# EAGLE design TeamB_PowerBoard (EAGLE 7.1.0)
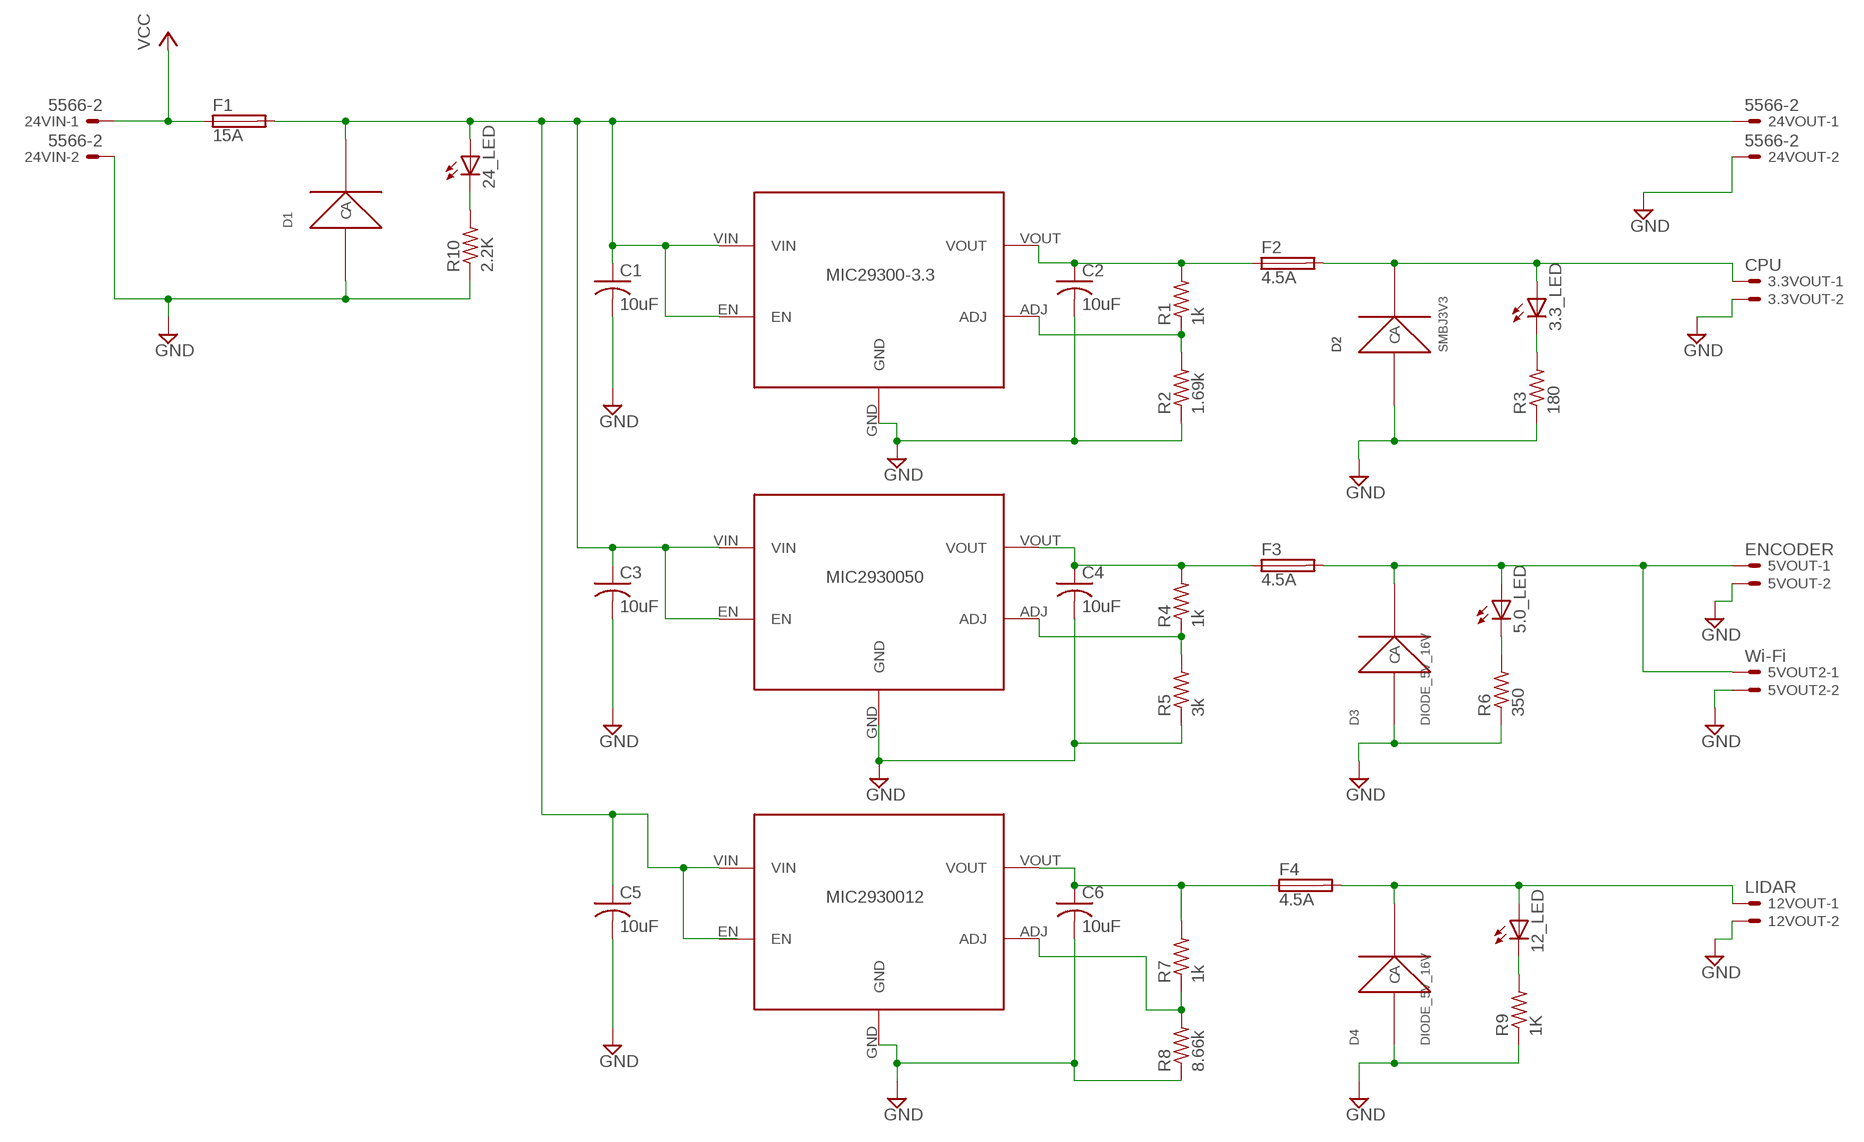
[diagram p0: schematic, sheet 1]

## Parts
3.3_LED  LEDSML1206  [SML1206]
3.3VOUT  CPU  C-GRID-02-70543  [70543-02]
5.0_LED  LEDSML1206  [SML1206]
5VOUT  ENCODER  C-GRID-02-70543  [70543-02]
5VOUT2  Wi-Fi  C-GRID-02-70543  [70543-02]
12_LED  LEDSML1206  [SML1206]
12VOUT  LIDAR  C-GRID-02-70543  [70543-02]
24_LED  LEDSML1206  [SML1206]
24VIN  5566-2  [5566-2]
24VOUT  5566-2  [5566-2]
C1  10uF  C-USC2220K  [C2220K]
C2  10uF  C-USC2220K  [C2220K]
C3  10uF  C-USC2220K  [C2220K]
C4  10uF  C-USC2220K  [C2220K]
C5  10uF  C-USC2220K  [C2220K]
C6  10uF  C-USC2220K  [C2220K]
D1  DIODE_26  [DIODE_26]
D2  SMBJ3V3  [SMBJ3V3]
D3  DIODE_5V_16V  [DIODE_5V_16V]
D4  DIODE_5V_16V  [DIODE_5V_16V]
F1  15A  TE5  [TE5]
F2  4.5A  TE5  [TE5]
F3  4.5A  TE5  [TE5]
F4  4.5A  TE5  [TE5]
R1  1k  R-US_R1206  [R1206]
R2  1.69k  R-US_R1206  [R1206]
R3  180  R-US_R1206  [R1206]
R4  1k  R-US_R1206  [R1206]
R5  3k  R-US_R1206  [R1206]
R6  350  R-US_R1206  [R1206]
R7  1k  R-US_R1206  [R1206]
R8  8.66k  R-US_R1206  [R1206]
R9  1K  R-US_R1206  [R1206]
R10  2.2K  R-US_R1206  [R1206]
U$1  MIC29300  [MIC29300WU]
U$2  MIC29300  [MIC29300WU]
U$3  MIC29300  [MIC29300WU]

## Nets
GND: 3.3VOUT.2 5VOUT2.2 5VOUT.2 12VOUT.2 24VIN.2 24VOUT.2 C1.2 C2.2 C3.2 C4.2 C5.2 C6.2 D1.1(A) D2.1(A) D3.1(A) D4.1(A) R2.1 R3.1 R5.1 R6.1 R8.1 R9.1 R10.1 U$1.GND U$2.GND U$3.GND
N$1: 24_LED.A 24VOUT.1 C1.1 C3.1 C5.1 D1.2(C) F1.2 U$1.EN U$1.VIN U$2.EN U$2.VIN U$3.VIN
N$2: 5.0_LED.C R6.2
N$3: 24_LED.C R10.2
N$4: 5.0_LED.A 5VOUT2.1 5VOUT.1 D3.2(C) F3.2
N$5: C2.1 F2.1 R1.2 U$1.VOUT
N$6: 12_LED.A 12VOUT.1 D4.2(C) F4.2
N$7: C4.1 F3.1 R4.2 U$2.VOUT
N$8: C6.1 F4.1 R7.2 U$3.VOUT
N$9: 3.3_LED.A 3.3VOUT.1 D2.2(C) F2.2
N$10: 12_LED.C R9.2
N$11: 3.3_LED.C R3.2
N$12: R1.1 R2.2 U$1.ADJ
N$13: R4.1 R5.2 U$2.ADJ
N$19: R7.1 R8.2 U$3.ADJ
VCC: 24VIN.1 F1.1
Unconnected: U$3.EN

## Library data of the parts
3.3_LED 5.0_LED 12_LED 24_LED = led:LED: LED OSRAM: - CHIPLED LG R971, LG N971, LY N971, LG Q971, LY Q971, LO R971, LY R971 LH N974, LH R974 LS Q976, LO Q976, LY Q976 LO Q996 - Hyper CHIPLED LW Q18S LB Q993, LB Q99A, LB R99A - SideLED LS A670, LO A670, LY A670, LG A670, LP A670 LB A673, LV A673, LT A673, LW A673 LH A674 LY A675 LS A676, LA A676, LO A676, LY A676, LW A676 LS A679, LY A679, LG A679 - Hyper Micro SIDELED® LS Y876, LA Y876, LO Y876, LY Y876 LT Y87S - SmartLED LW L88C, LW L88S LB L89C, LB L89S, LG L890 LS L89K, LO L89K, LY L89K LS L896, LA L896, LO L896, LY L896 - TOPLED LS T670, LO T670, LY T670, LG T670, LP T670 LSG T670, LSP T670, LSY T670, LOP T670, LYG T670 LG T671, LOG T671, LSG T671 LB T673, LV T673, LT T673, LW T673 LH T674 LS T676, LA T676, LO T676, LY T676, LB T676, LH T676, LSB T676, LW T676 LB T67C, LV T67C, LT T67C, LS T67K, LO T67K, LY T67K, LW E67C LS E67B, LA E67B, LO E67B, LY E67B, LB E67C, LV E67C, LT E67C LW T67C LS T679, LY T679, LG T679 LS T770, LO T770, LY T770, LG T770, LP T770 LB T773, LV T773, LT T773, LW T773 LH T774 LS E675, LA E675, LY E675, LS T675 LS T776, LA T776, LO T776, LY T776, LB T776 LHGB T686 LT T68C, LB T68C - Hyper Mini TOPLED® LB M676 - Mini TOPLED Santana® LG M470 LS M47K, LO M47K, LY M47K Source: http://www.osram.convergy.de LUXEON: - LUMILED® LXK2-PW12-R00, LXK2-PW12-S00, LXK2-PW14-U00, LXK2-PW14-V00 LXK2-PM12-R00, LXK2-PM12-S00, LXK2-PM14-U00 LXK2-PE12-Q00, LXK2-PE12-R00, LXK2-PE12-S00, LXK2-PE14-T00, LXK2-PE14-U00 LXK2-PB12-K00, LXK2-PB12-L00, LXK2-PB12-M00, LXK2-PB14-N00, LXK2-PB14-P00, LXK2-PB14-Q00 LXK2-PR12-L00, LXK2-PR12-M00, LXK2-PR14-Q00, LXK2-PR14-R00 LXK2-PD12-Q00, LXK2-PD12-R00, LXK2-PD12-S00 LXK2-PH12-R00, LXK2-PH12-S00 LXK2-PL12-P00, LXK2-PL12-Q00, LXK2-PL12-R00 Source: www.luxeon.com KINGBRIGHT: KA-3528ASYC Source: www.kingbright.com
3.3VOUT 5VOUT 5VOUT2 12VOUT = con-molex:C-GRID-02: CONNECTOR wire to board 2.54 mm (0.100") pitch header; OC_FARNELL: unknown; OC_NEWARK: unknown
24VIN 24VOUT = con-molex:5566-2: Mini FIT connector 2 pol Source: http://www.molex.com; OC_FARNELL: 1822072; OC_NEWARK: unknown
C1-C6 = resistor:C-US: CAPACITOR, American symbol
D1 = TVS_Diode:DIODE_26
D2 = TVS_Diode:SMBJ3V3
D3 D4 = TVS_Diode:DIODE_5V_16V
F1-F4 = fuse:TE5: FUSE Wickmann; OC_FARNELL: unknown; OC_NEWARK: unknown
R1-R10 = rcl:R-US_: RESISTOR, American symbol
U$1 = MIC2930033WU:MIC29300: MIC29150/29300/29500/29750 are high current, high accuracy, low-dropout voltage regulators.
U$2 = MIC2930050WU:MIC29300: MIC29150/29300/29500/29750 are high current, high accuracy, low-dropout voltage regulators.
U$3 = MIC2930012WU:MIC29300: MIC29150/29300/29500/29750 are high current, high accuracy, low-dropout voltage regulators.

## Board
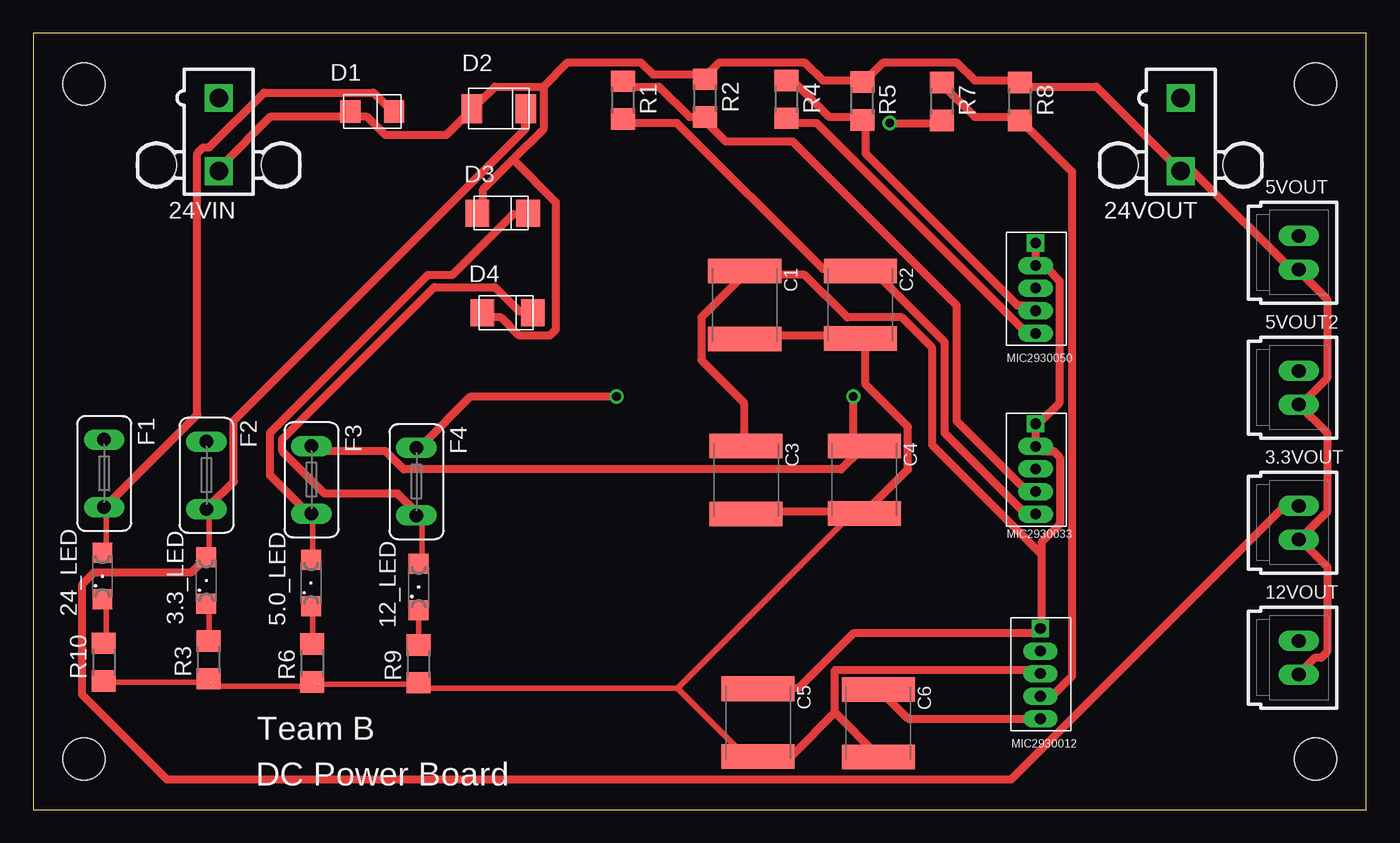
[diagram p1: board, top side]
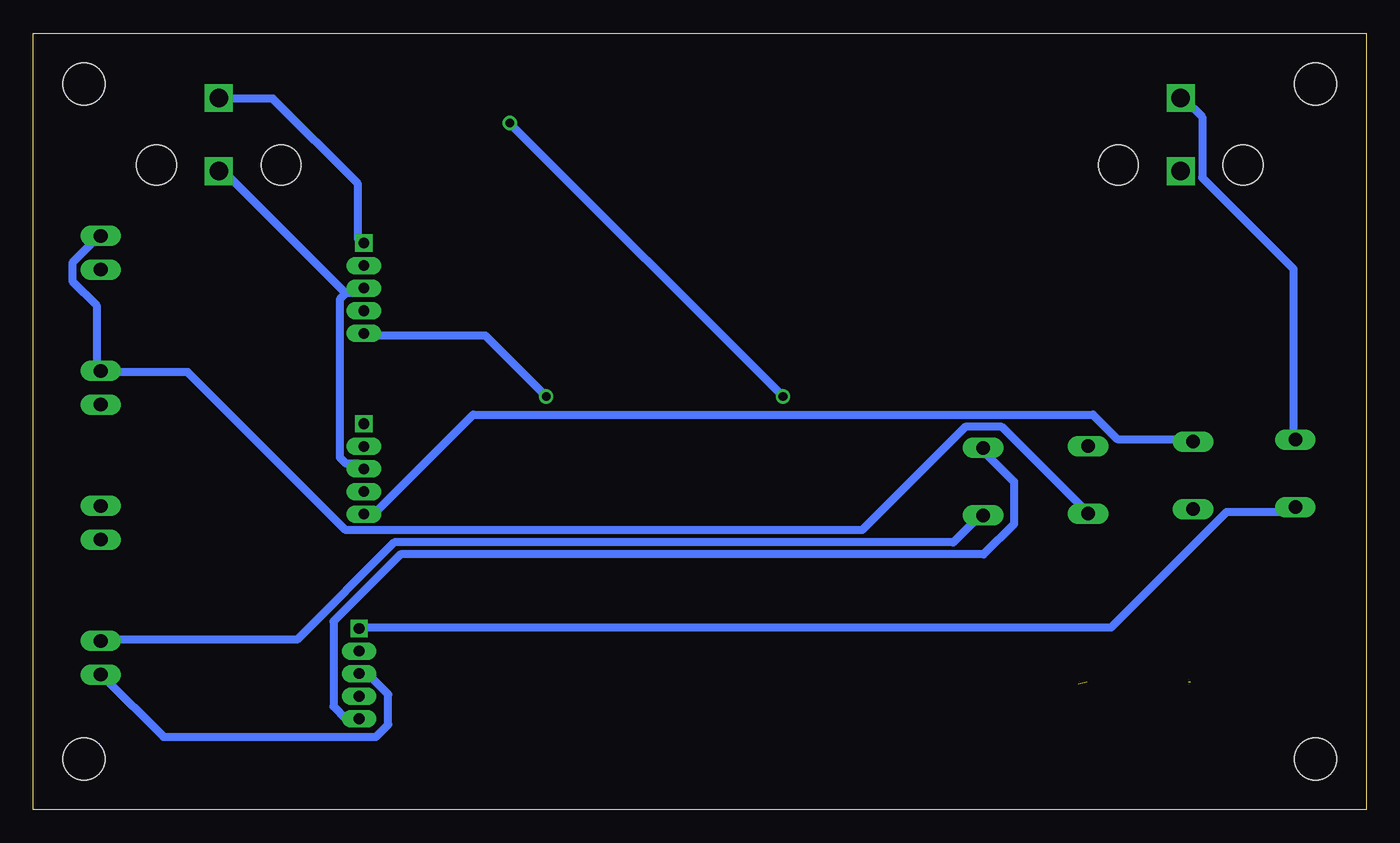
[diagram p2: board, bottom side, seen from below]

Size 100.33 x 58.42 mm. Coordinates in mm from the lower left corner, seen from the top.
Outline: 0,0 100.33,0 100.33,58.42 0,58.42 0,0
Copper layers (1*16): Top 0.035mm / dielectric 1.5mm / Bottom 0.035mm
Design rules "default *": minimum track width 12mil, minimum drill 26mil, track to track 12mil, track to pad 8mil, pad to pad 8mil, via to via 8mil, smd to smd 8mil, copper to edge 40mil, drill to drill 8mil, minimum pad ring 10mil, minimum via ring 8mil, stop-mask expansion 4mil, vias tented up to drill 0mil, thermal gap 10mil
Holes 3.17 mm at 3.81,3.81 96.52,3.81 96.52,54.61 3.81,54.61
tKeepout: area 1,51.8 to 6.6,57.4; area 1,1 to 6.6,6.6; area 93.7,1 to 99.3,6.6; area 93.7,51.8 to 99.3,57.4

### Footprints (pad centres in the part's own frame; a part is rotated, then mirrored left to right if it is on the bottom)
SML1206 = smd 1.5 x 1.5: A 1.75,0; C -1.75,0
70543-02 = drill 1.016 long: 1 -1.27,0; 2 1.27,0
5566-2 = drill 1.4 square: 1 0,-2.75; 2 0,2.75 | hole 3: 4.7,2.29; -4.7,2.29
C2220K = smd 1.85 x 5.5: 1 -2.55,0; 2 2.55,0
DIODE_26 = smd 1.524 x 1.676: 1 -0.762,0; 2 2.54,0
SMBJ3V3 = smd 1.524 x 2.184: 1 -2.032,0; 2 2.032,0
DIODE_5V_16V = smd 1.778 x 2.032: 1 -0.762,0; 2 3.048,0
TE5 = drill 1.016 long: 1 -2.54,0; 2 2.54,0
R1206 = smd 1.6 x 1.803: 1 -1.422,0; 2 1.422,0
MIC29300WU = drill 0.8 pad 1.27 long: ADJ 2.2,2.6; EN 2.2,6; GND 2.2,4.3; VOUT 2.2,0.9 | drill 0.8 pad 1.27 square: VIN 2.2,7.7

### Placement (x,y rotation side)
3.3_LED  13.03,17.24 90 top
3.3VOUT  95.25,21.59 270 top
5.0_LED  20.91,17.05 90 top
5VOUT  95.25,41.91 270 top
5VOUT2  95.25,31.75 270 top
12_LED  29.01,16.76 90 top
12VOUT  95.25,11.43 270 top
24_LED  5.21,17.57 90 top
24VIN  13.97,50.8 180 top
24VOUT  86.36,50.8 180 top
C1  53.55,37.97 270 top
C2  62.25,37.99 270 top
C3  53.65,24.81 270 top
C4  62.55,24.83 270 top
C5  54.55,6.55 270 top
C6  63.61,6.51 270 top
D1  24.63,52.54 0 top
D2  35.05,52.75 0 top
D3  34.2,44.89 0 top
D4  34.56,37.39 0 top
F1  5.34,25.3 270 top
F2  13.04,25.16 270 top
F3  20.94,24.82 270 top
F4  28.84,24.68 270 top
R1  44.4,53.38 270 top
R2  50.58,53.53 270 top
R3  13.19,11.28 90 top
R4  56.7,53.44 270 top
R5  62.4,53.32 270 top
R6  20.99,11.04 90 top
R7  68.4,53.28 270 top
R8  74.28,53.28 270 top
R9  28.99,10.98 90 top
R10  5.31,11.11 90 top
U$1  73.25,21.34 0 top
U$2  73.25,34.94 0 top
U$3  73.6,5.94 0 top

### Tracks (layer width: path | path; a pad name or v marks a point on that pad's centre or on a via)
GND  (2 unrouted)
  Top 0.406: 5.49,9.6 13.39,9.6 13.39,9.3 21.67,9.3 21.67,9.44 29.26,9.44 29.26,9.14 48.5,9.14 | 48.5,9.14 61.76,22.4 | 54.41,4.12 53.53,4.12 48.5,9.14
  Top 0.61: C1.2 53.95,35.66 62.18,35.66 C2.2 62.64,35.2 62.64,32 65.84,28.8 65.84,25.6 62.64,22.4 C4.2 62.18,22.4 61.76,22.4 53.95,22.4 C3.2 53.49,21.95 | 5.49,9.6 R10.1 | 12.8,9.6 R3.1 13.26,9.6 | 20.57,9.6 R6.1 21.03,9.6 | 28.8,9.6 R9.1 29.26,9.14 | 60.35,7.32 60.35,10.52 75.44,10.52 U$3.GND | 60.35,7.32 63.55,4.12 C6.2 | 60.35,7.32 57.15,4.12 54.86,4.12 C5.2 54.41,4.12 | 12VOUT.2 95.56,10.52 96.47,11.43 96.93,11.43 97.38,11.89 97.38,18.29 95.56,20.12 3.3VOUT.2 95.56,20.57 97.38,22.4 97.38,28.35 5VOUT2.2 95.56,30.63 97.38,32.46 97.38,38.41 95.56,40.23 5VOUT.2 95.1,40.23 87.33,48.01 86.41,48.01 24VOUT.2 85.95,48.46 80.01,54.41 74.52,54.41 R8.1 74.07,54.86 70.87,54.86 69.49,56.24 64.01,56.24 62.64,54.86 R5.1 62.18,54.86 59.44,54.86 58.06,56.24 51.66,56.24 50.75,55.32 R2.1 50.29,55.32 46.63,55.32 45.72,56.24 40.23,56.24 38.41,54.41 | 36.12,48.92 38.41,51.21 38.41,54.41 | 36.12,48.92 33.83,46.63 33.83,45.26 D3.1 | 38.41,54.41 34.75,54.41 33.38,53.03 D2.1 32.92,52.58 31.09,50.75 26.52,50.75 25.15,52.12 24.23,52.12 D1.1 23.77,52.12 17.83,52.12 14.17,48.46 24VIN.2 | 36.12,48.92 39.32,45.72 39.32,36.12 38.86,35.66 36.58,35.66 35.2,37.03 33.83,37.03 D4.1
  Bottom 0.61: 76.81,38.86 77.27,38.41 77.27,26.52 76.81,26.06 75.89,26.06 U$1.GND | 76.81,38.86 75.89,38.86 U$2.GND | 76.81,38.86 85.95,48.01 24VOUT.2 | U$3.GND 75.44,10.06 74.98,10.06 73.61,8.69 73.61,6.4 74.52,5.49 90.53,5.49 95.1,10.06 12VOUT.2
N$1
  Top 0.406: 5.49,22.4 5.49,19.6 24_LED.A
  Top 0.61: 5.49,19.66 24_LED.A | 5.49,22.4 F1.2 5.49,22.86 12.34,29.72 12.34,49.38 12.8,49.84 13.26,49.84 17.37,53.95 25.6,53.95 26.98,52.58 D1.2 | C3.1 53.49,27.43 53.49,30.63 50.29,33.83 50.29,37.03 53.49,40.23 C1.1 53.95,40.23 58.06,40.23 61.27,37.03 65.38,37.03 67.67,34.75 67.67,27.43 75.89,19.2 | U$2.VIN 75.44,42.52 75.44,41.15 U$2.EN 75.89,40.69 76.35,40.69 77.27,39.78 77.27,30.63 75.89,29.26 U$1.VIN 75.44,28.8 75.44,27.43 U$1.EN 75.89,26.98 76.81,26.98 77.27,26.52 77.27,21.49 75.89,20.12 75.89,19.2 | 75.89,19.2 75.89,13.72 U$3.VIN 75.44,13.26 61.72,13.26 57.61,9.14 54.86,9.14 C5.1
  Bottom 0.61: 24VOUT.1 85.95,53.49 82.3,53.49 75.89,47.09 75.89,42.98 U$2.VIN | F1.2 5.49,22.4 10.52,22.4 19.2,13.72 75.44,13.72 U$3.VIN
N$2
  Top 0.406: 21.03,15.09 21.03,12.5 R6.2
  Top 0.61: 21.03,15.09 5.0_LED.C | 21.03,12.8 R6.2
N$3
  Top 0.406: 5.49,15.54 5.49,12.71 R10.2
  Top 0.61: 5.49,15.54 24_LED.C | 5.49,12.8 R10.2
N$4
  Top 0.406: 21.03,21.95 21.03,18.92 5.0_LED.A
  Top 0.61: 21.03,19.2 5.0_LED.A | 21.03,21.95 F3.2 20.57,22.4 17.83,25.15 17.83,28.35 29.72,40.23 31.55,40.23 36.12,44.81 37.03,44.81 D3.2
  Bottom 0.61: 5VOUT.1 95.56,42.98 97.38,41.15 97.38,39.78 95.56,37.95 95.56,33.38 5VOUT2.1 95.1,32.92 88.7,32.92 76.81,21.03 37.95,21.03 30.18,28.8 27.43,28.8 21.03,22.4 F3.2
N$5
  Top 0.61: R1.2 44.81,51.66 48.46,51.66 59.44,40.69 62.18,40.69 C2.1 62.64,40.23 63.55,40.23 68.58,35.2 68.58,28.35 74.52,22.4 75.44,22.4 U$1.VOUT
  Bottom 0.61: F2.1 13.26,27.89 18.75,27.89 20.57,29.72 67.21,29.72 74.52,22.4 75.44,22.4 U$1.VOUT
N$6
  Top 0.406: 29.26,21.95 29.26,18.76 12_LED.A
  Top 0.61: 29.26,18.75 12_LED.A | 29.26,21.95 F4.2 28.8,22.4 27.43,23.77 21.95,23.77 18.75,26.98 18.75,27.89 30.18,39.32 34.75,39.32 36.58,37.49 37.49,37.49 D4.2
  Bottom 0.61: 12VOUT.1 95.1,12.8 80.47,12.8 73.15,20.12 31.09,20.12 29.26,21.95 F4.2
N$7  (via drill 0.66)
  Top 0.61: R4.2 57.15,51.66 58.98,51.66 74.52,36.12 75.44,36.12 U$2.VOUT | F3.1 21.03,26.98 26.52,26.98 27.89,25.6 60.81,25.6 62.18,26.98 C4.1 62.18,27.43 61.72,27.89 v61.72,31.09
  Bottom 0.61: v61.72,31.09 66.29,35.66 75.44,35.66 U$2.VOUT
N$8  (via drill 0.66)
  Top 0.61: U$3.VOUT 75.44,6.86 65.84,6.86 64.01,8.69 C6.1 | v64.47,51.66 68.12,51.66 R7.2 | v43.89,31.09 32.92,31.09 29.26,27.43 F4.1
  Bottom 0.61: v43.89,31.09 v64.47,51.66 | U$3.VOUT 75.89,6.86 76.81,6.86 77.72,7.77 77.72,14.17 72.69,19.2 28.8,19.2 26.52,21.49 26.52,24.69 28.8,26.98 F4.1
N$9
  Top 0.406: 13.26,22.4 13.26,19.22 3.3_LED.A
  Top 0.61: 13.26,19.2 3.3_LED.A 12.8,18.75 11.89,17.83 4.57,17.83 3.66,16.92 3.66,8.69 10.06,2.29 73.61,2.29 94.18,22.86 3.3VOUT.1 | 13.26,22.4 F2.2 13.26,22.86 15.09,24.69 15.09,29.26 37.03,51.21 37.03,52.58 D2.2
N$10
  Top 0.406: 12_LED.C 29.01,12.42 R9.2
  Top 0.61: 29.26,12.8 R9.2
N$11
  Top 0.406: 13.26,15.09 13.26,12.77 R3.2
  Top 0.61: 13.26,15.09 3.3_LED.C | 13.26,12.8 R3.2
N$12
  Top 0.61: R1.1 44.81,54.41 47.09,54.41 49.38,52.12 50.29,52.12 R2.2 50.75,51.66 52.12,50.29 57.15,50.29 69.49,37.95 69.49,29.26 74.52,24.23 75.44,24.23 U$1.ADJ
N$13
  Top 0.61: R4.1 57.15,54.86 59.89,52.12 62.18,52.12 R5.2 62.64,51.66 62.64,49.38 74.07,37.95 75.44,37.95 U$2.ADJ
N$19
  Top 0.61: R7.1 68.58,54.41 70.87,52.12 74.07,52.12 R8.2 74.52,51.66 78.18,48.01 78.18,10.06 76.81,8.69 75.89,8.69 U$3.ADJ
VCC
  Bottom 0.61: F1.1 5.49,27.89 5.49,40.69 12.34,47.55 12.34,52.12 13.72,53.49 24VIN.1

### Text on the board
tNames: Team B | DC Power Board